# EAGLE design AS3364 bus mixer v1.0 (EAGLE 9.6.2)
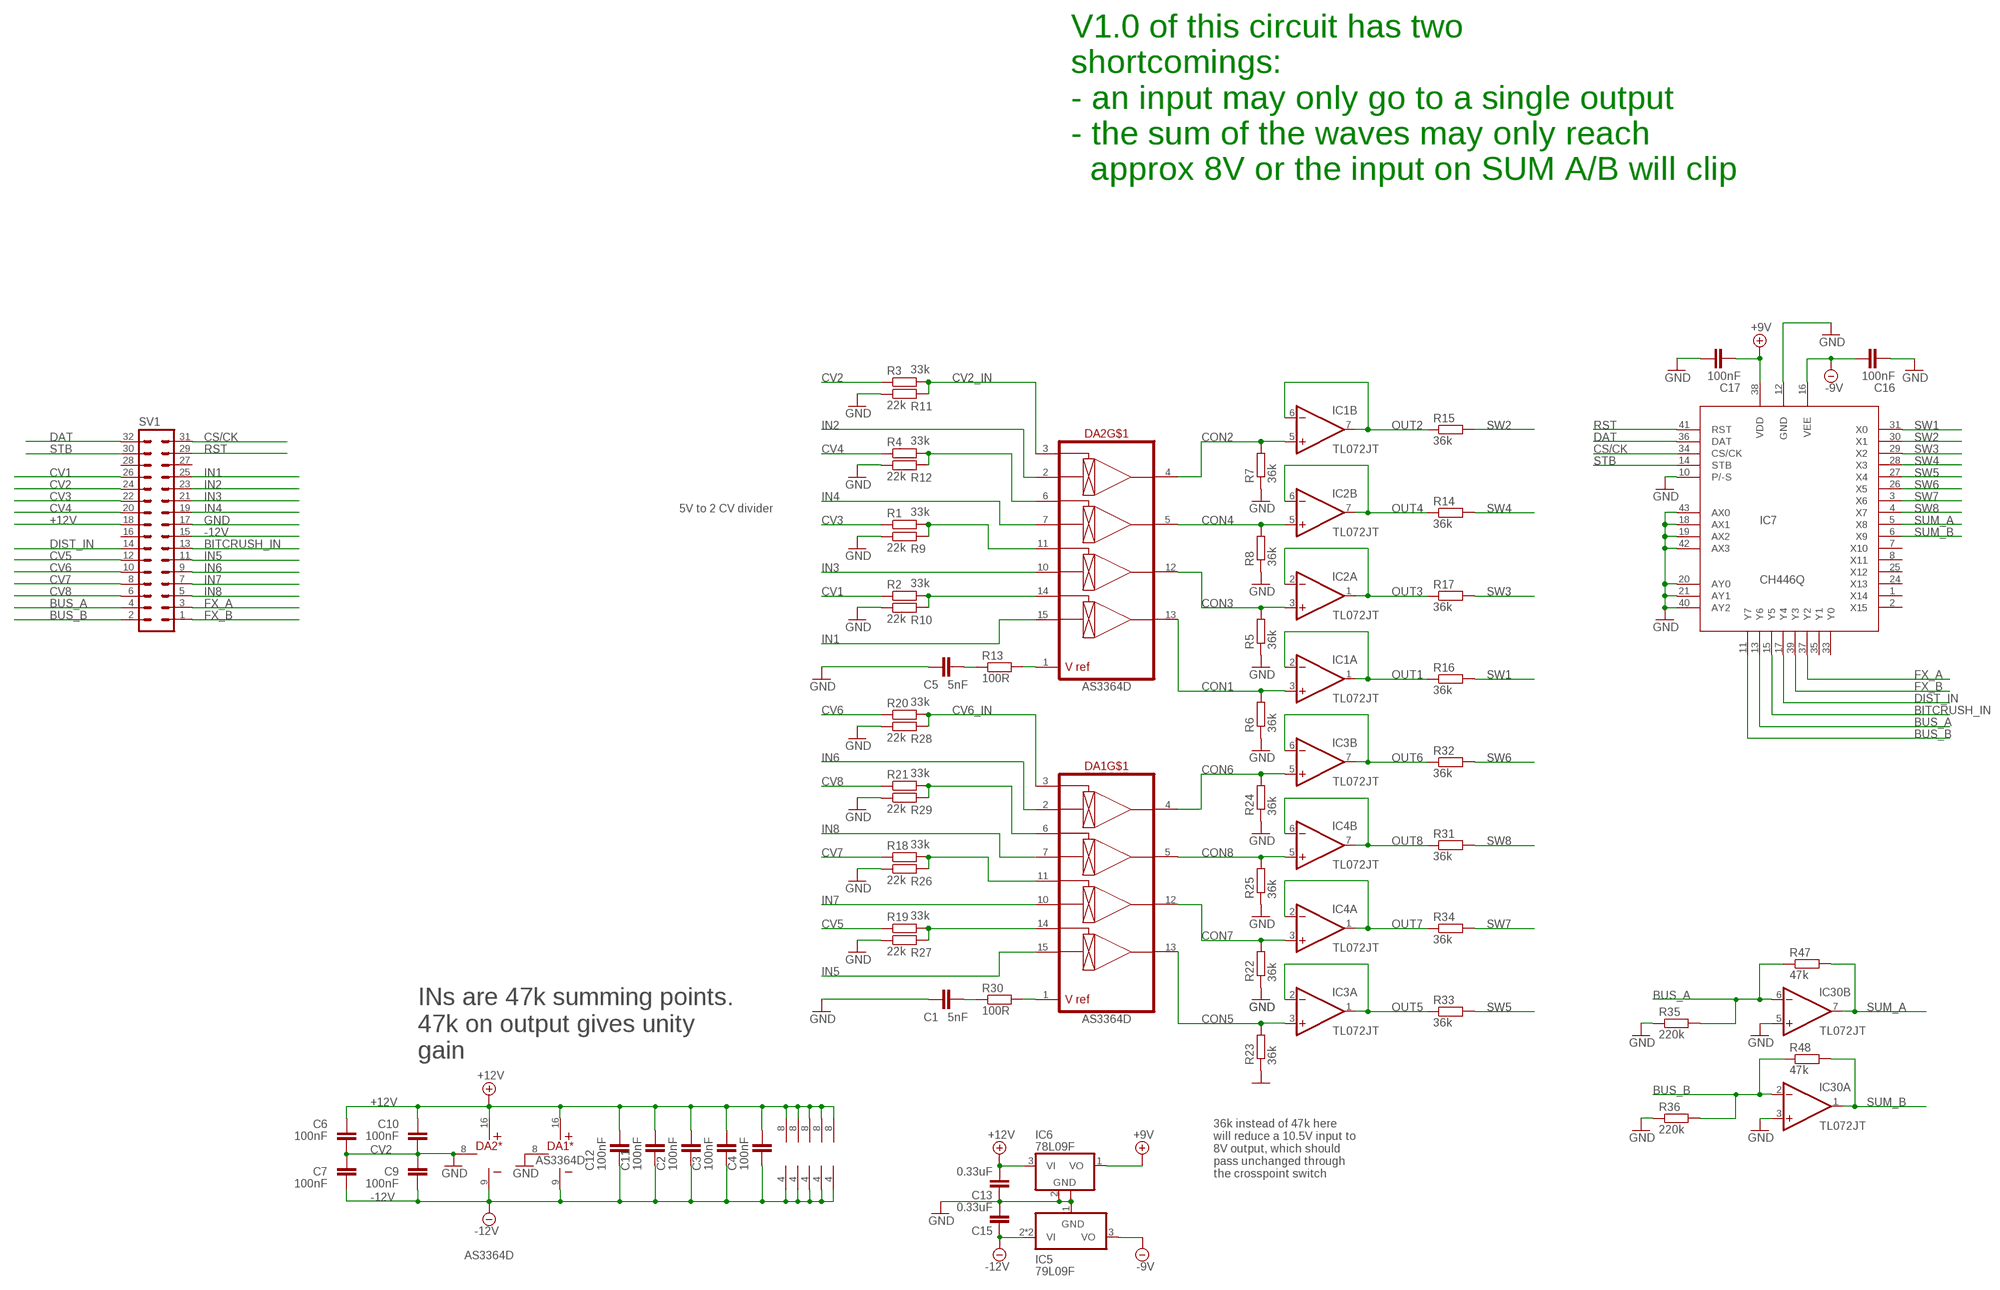
[diagram p0: schematic, sheet 1]

## Parts
C1  5nF  C-EUC0402  [C0402]
C2  100nF  C-EUC0402  [C0402]
C3  100nF  C-EUC0402  [C0402]
C4  100nF  C-EUC0402  [C0402]
C5  5nF  C-EUC0402  [C0402]
C6  100nF  C-EUC0402  [C0402]
C7  100nF  C-EUC0402  [C0402]
C9  100nF  C-EUC0402  [C0402]
C10  100nF  C-EUC0402  [C0402]
C11  100nF  C-EUC0402  [C0402]
C12  100nF  C-EUC0402  [C0402]
C13  0.33uF  C-EUC0603  [C0603]
C15  0.33uF  C-EUC0603  [C0603]
C16  100nF  C-EUC0402  [C0402]
C17  100nF  C-EUC0402  [C0402]
DA1  AS3364D  [DIL16J]
DA2  AS3364D  [DIL16J]
IC1  TL072JT  [TSSOP8J]
IC2  TL072JT  [TSSOP8J]
IC3  TL072JT  [TSSOP8J]
IC4  TL072JT  [TSSOP8J]
IC5  79L09F  [SOT89]
IC6  78L09F  [SOT89]
IC7  CH446Q  [LQFP-44-J]
IC30  TL072JT  [TSSOP8J]
R1  33k  R-EU_R0402  [R0402]
R2  33k  R-EU_R0402  [R0402]
R3  33k  R-EU_R0402  [R0402]
R4  33k  R-EU_R0402  [R0402]
R5  36k  R-EU_R0402  [R0402]
R6  36k  R-EU_R0402  [R0402]
R7  36k  R-EU_R0402  [R0402]
R8  36k  R-EU_R0402  [R0402]
R9  22k  R-EU_R0402  [R0402]
R10  22k  R-EU_R0402  [R0402]
R11  22k  R-EU_R0402  [R0402]
R12  22k  R-EU_R0402  [R0402]
R13  100R  R-EU_R0402  [R0402]
R14  36k  R-EU_R0402  [R0402]
R15  36k  R-EU_R0402  [R0402]
R16  36k  R-EU_R0402  [R0402]
R17  36k  R-EU_R0402  [R0402]
R18  33k  R-EU_R0402  [R0402]
R19  33k  R-EU_R0402  [R0402]
R20  33k  R-EU_R0402  [R0402]
R21  33k  R-EU_R0402  [R0402]
R22  36k  R-EU_R0402  [R0402]
R23  36k  R-EU_R0402  [R0402]
R24  36k  R-EU_R0402  [R0402]
R25  36k  R-EU_R0402  [R0402]
R26  22k  R-EU_R0402  [R0402]
R27  22k  R-EU_R0402  [R0402]
R28  22k  R-EU_R0402  [R0402]
R29  22k  R-EU_R0402  [R0402]
R30  100R  R-EU_R0402  [R0402]
R31  36k  R-EU_R0402  [R0402]
R32  36k  R-EU_R0402  [R0402]
R33  36k  R-EU_R0402  [R0402]
R34  36k  R-EU_R0402  [R0402]
R35  220k  R-EU_R0402  [R0402]
R36  220k  R-EU_R0402  [R0402]
R47  47k  R-EU_R0402  [R0402]
R48  47k  R-EU_R0402  [R0402]
SV1  MA16-2WJ  [MA16-2WJ]

## Nets
+9V: C17.1 IC6.1(VO) IC7.38(VDD)
+12V: C2.2 C3.2 C4.2 C6.2 C10.2 C11.2 C12.2 C13.2 DA1.16(*:V+) DA2.16(*:V+) IC1.8(P:V+) IC2.8(P:V+) IC3.8(P:V+) IC4.8(P:V+) IC6.3(VI) IC30.8(P:V+) SV1.18
-9V: C16.2 IC5.3(VO) IC7.16(VEE)
-12V: C2.1 C3.1 C4.1 C7.1 C9.1 C11.1 C12.1 C15.1 DA1.9(*:V-) DA2.9(*:V-) IC1.4(P:V-) IC2.4(P:V-) IC3.4(P:V-) IC4.4(P:V-) IC5.2(VI) IC5.2@1(VI) IC30.4(P:V-) SV1.15
BITCRUSH_IN: IC7.15(Y5) SV1.13
BUS_A: IC7.13(Y6) IC30.6(B:-IN) R35.2 R47.1 SV1.4
BUS_B: IC7.11(Y7) IC30.2(A:-IN) R36.2 R48.1 SV1.2
CON1: DA2.13(OUT4) IC1.3(A:+IN) R6.2
CON2: DA2.4(OUT1) IC1.5(B:+IN) R7.2
CON3: DA2.12(OUT3) IC2.3(A:+IN) R5.2
CON4: DA2.5(OUT2) IC2.5(B:+IN) R8.2
CON5: DA1.13(OUT4) IC3.3(A:+IN) R23.2
CON6: DA1.4(OUT1) IC3.5(B:+IN) R24.2
CON7: DA1.12(OUT3) IC4.3(A:+IN) R22.2
CON8: DA1.5(OUT2) IC4.5(B:+IN) R25.2
CS/CK: IC7.34(CS/CK) SV1.31
CV1: R2.1 SV1.26
CV2: R3.1 SV1.24
CV2_IN: DA2.3(CV1) R3.2 R11.2
CV3: R1.1 SV1.22
CV4: R4.1 SV1.20
CV5: R19.1 SV1.12
CV6: R20.1 SV1.10
CV6_IN: DA1.3(CV1) R20.2 R28.2
CV7: R18.1 SV1.8
CV8: R21.1 SV1.6
DAT: IC7.36(DAT) SV1.32
DIST_IN: IC7.17(Y4) SV1.14
FX_A: IC7.37(Y2) SV1.3
FX_B: IC7.39(Y3) SV1.1
GND: C1.1 C5.1 C6.1 C7.2 C9.2 C10.1 C13.1 C15.2 C16.1 C17.2 DA1.8(*:GND) DA2.8(*:GND) IC5.1(GND) IC6.2(GND) IC6.2@1(GND) IC7.10(P/-S) IC7.12(GND) IC7.18(AX1) IC7.19(AX2) IC7.20(AY0) IC7.21(AY1) IC7.40(AY2) IC7.42(AX3) IC7.43(AX0) IC30.3(A:+IN) IC30.5(B:+IN) R5.1 R6.1 R7.1 R8.1 R9.1 R10.1 R11.1 R12.1 R22.1 R23.1 R24.1 R25.1 R26.1 R27.1 R28.1 R29.1 R35.1 R36.1 SV1.17
IN1: DA2.15(IN4) SV1.25
IN2: DA2.2(IN1) SV1.23
IN3: DA2.10(IN3) SV1.21
IN4: DA2.7(IN2) SV1.19
IN5: DA1.15(IN4) SV1.11
IN6: DA1.2(IN1) SV1.9
IN7: DA1.10(IN3) SV1.7
IN8: DA1.7(IN2) SV1.5
N$1: DA1.1(VREF) R30.2
N$2: DA2.1(VREF) R13.2
N$3: DA1.6(CV2) R21.2 R29.2
N$5: DA1.11(CV3) R18.2 R26.2
N$7: DA1.14(CV4) R19.2 R27.2
N$8: C1.2 R30.1
N$10: DA2.6(CV2) R4.2 R12.2
N$12: DA2.11(CV3) R1.2 R9.2
N$14: C5.2 R13.1
N$21: DA2.14(CV4) R2.2 R10.2
OUT1: IC1.1(A:OUT) IC1.2(A:-IN) R16.1
OUT2: IC1.6(B:-IN) IC1.7(B:OUT) R15.1
OUT3: IC2.1(A:OUT) IC2.2(A:-IN) R17.1
OUT4: IC2.6(B:-IN) IC2.7(B:OUT) R14.1
OUT5: IC3.1(A:OUT) IC3.2(A:-IN) R33.1
OUT6: IC3.6(B:-IN) IC3.7(B:OUT) R32.1
OUT7: IC4.1(A:OUT) IC4.2(A:-IN) R34.1
OUT8: IC4.6(B:-IN) IC4.7(B:OUT) R31.1
RST: IC7.41(RST) SV1.29
STB: IC7.14(STB) SV1.30
SUM_A: IC7.5(X8) IC30.7(B:OUT) R47.2
SUM_B: IC7.6(X9) IC30.1(A:OUT) R48.2
SW1: IC7.31(X0) R16.2
SW2: IC7.30(X1) R15.2
SW3: IC7.29(X2) R17.2
SW4: IC7.28(X3) R14.2
SW5: IC7.27(X4) R33.2
SW6: IC7.26(X5) R32.2
SW7: IC7.3(X6) R34.2
SW8: IC7.4(X7) R31.2
Unconnected: IC7.1(X14) IC7.2(X15) IC7.7(X10) IC7.8(X11) IC7.24(X13) IC7.25(X12) IC7.33(Y0) IC7.35(Y1) SV1.16 SV1.27 SV1.28

## Notes on the sheet
- V1.0 of this circuit has two
  shortcomings:
  - an input may only go to a single output
  - the sum of the waves may only reach
    approx 8V or the input on SUM A/B will clip
- 5V to 2 CV divider
- INs are 47k summing points.
  47k on output gives unity
  gain
- 36k instead of 47k here 
  will reduce a 10.5V input to
  8V output, which should
  pass unchanged through
  the crosspoint switch

## Library data of the parts
C1-C7 C9-C12 C16 C17 = rcl:C-EU: CAPACITOR, European symbol; SPICEPREFIX: C
C13 C15 = resistor:C-EU: CAPACITOR, European symbol
DA1 DA2 = joakim:AS3364: AS3364 quad linear VCA, CEM3360 style. CV is 0 to 2V Vcc-Vee = 26V max, so +/-12V or +15V/-9V
IC1-IC4 IC30 = joakim:TL072J: OP AMP
IC5 = joakim:79L*: NEGATIVE-VOLTAGE REGULATORS Output up to 100 mA
IC6 = linear:78L*: POSITOIV-VOLTAGE REGULATORS Output up to 100 mA Source: Datasheet <http://focus.ti.com/lit/ds/symlink/ua78l05.pdf>
IC7 = joakim:CH446Q: 8x16 matrix analog switch chip, contains 128 analog switches, used for arbitrary routing of 8x16 signal channels. CH446 supports 4V to 12V single supply voltage, and supports +5V and -7V dual power supply voltage. The ON resistance is not greater than 65Ω. https://www.wch-ic.com/downloads/CH446DS1_PDF.html
R1-R36 R47 R48 = rcl:R-EU_: RESISTOR, European symbol; SPICEPREFIX: R
SV1 = joakim:MA16-2WJ: PIN HEADER; OC_FARNELL: unknown; OC_NEWARK: unknown

## Board
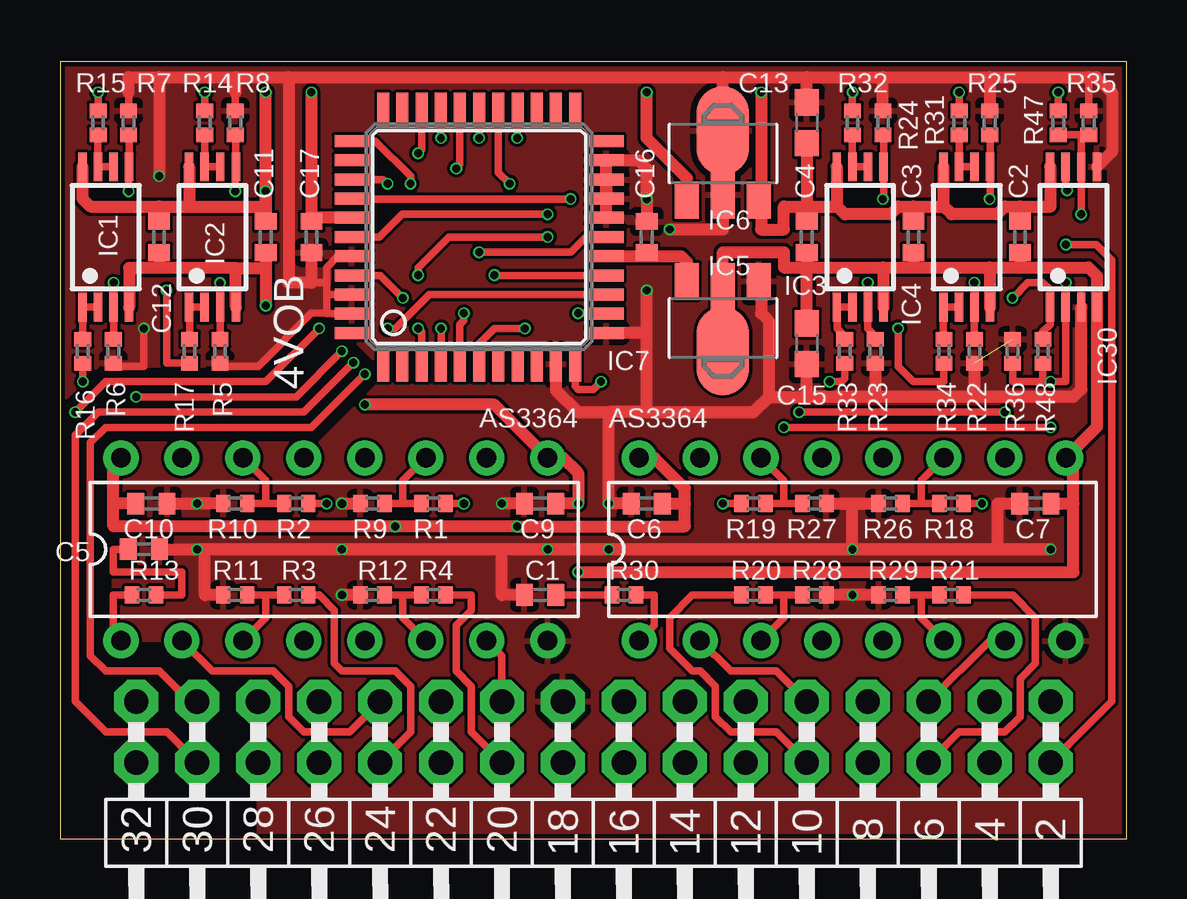
[diagram p1: board, top side]
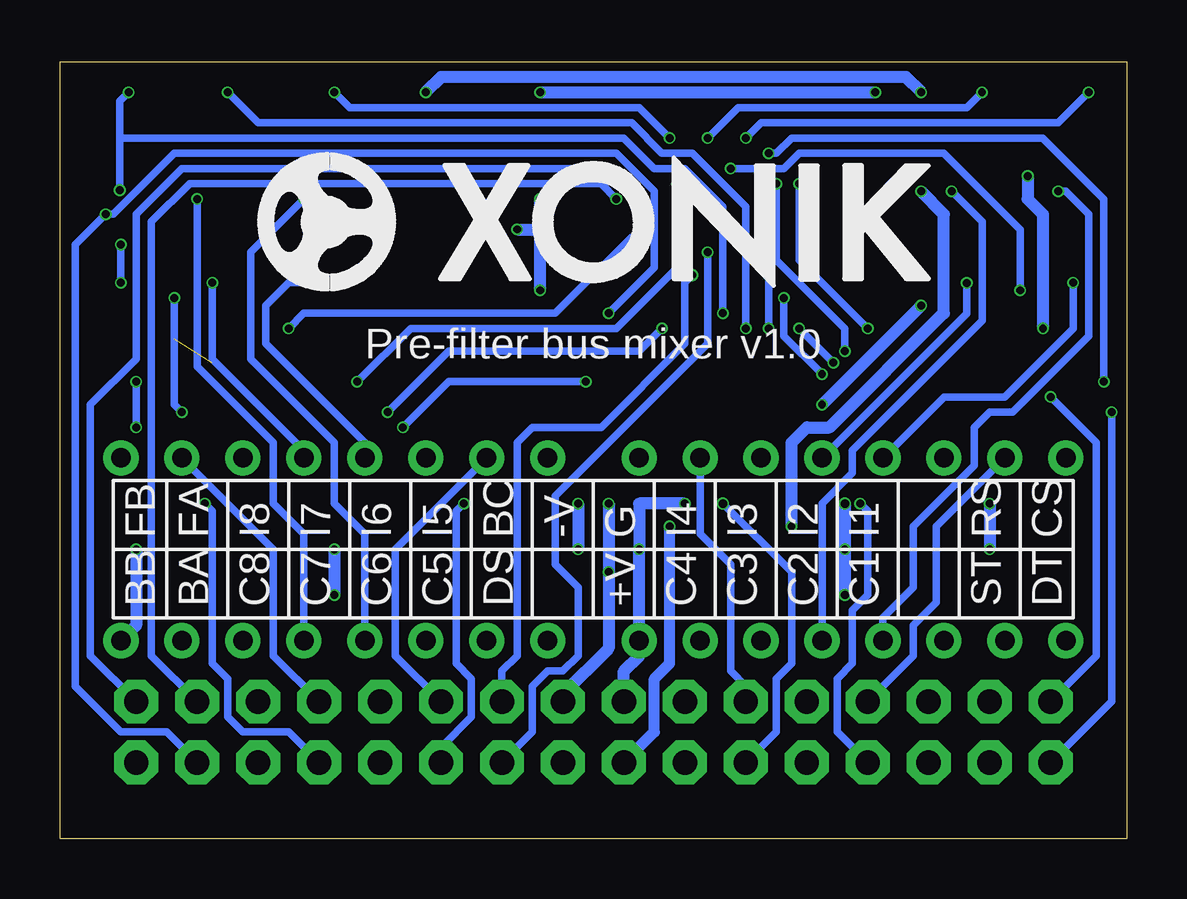
[diagram p2: board, bottom side, seen from below]

Size 44.45 x 32.38 mm. Coordinates in mm from the lower left corner, seen from the top.
Outline: 0,0 44.45,0 44.45,32.39 0,32.39 0,0
Copper layers (1*16): Top 0.035mm / dielectric 1.6mm / Bottom 0.035mm
Design rules "jlcpcb-2layers": minimum track width 5mil, minimum drill 0.3mm, track to track 5mil, track to pad 5mil, pad to pad 5mil, via to via 5mil, smd to smd 5mil, copper to edge 0.2mm, drill to drill 6mil, minimum pad ring 10mil, minimum via ring 3mil, stop-mask expansion 4mil, vias tented up to drill 0mil, thermal gap 10mil

### Footprints (pad centres in the part's own frame; a part is rotated, then mirrored left to right if it is on the bottom)
C0402 = smd 0.7 x 0.9: 1 -0.65,0; 2 0.65,0
C0603 = smd 1.1 x 1: 1 -0.85,0; 2 0.85,0
DIL16J = drill 0.813: 1 -8.89,-3.81; 2 -6.35,-3.81; 3 -3.81,-3.81; 4 -1.27,-3.81; 5 1.27,-3.81; 6 3.81,-3.81; 7 6.35,-3.81; 8 8.89,-3.81; 9 8.89,3.81; 10 6.35,3.81; 11 3.81,3.81; 12 1.27,3.81; 13 -1.27,3.81; 14 -3.81,3.81; 15 -6.35,3.81; 16 -8.89,3.81
TSSOP8J = smd 1.2 x 0.35: 1 -2.925,0.975; 2 -2.925,0.325; 3 -2.925,-0.325; 4 -2.925,-0.975; 5 2.925,-0.975; 6 2.925,-0.325; 7 2.925,0.325; 8 2.925,0.975
SOT89 = smd 1 x 1.5: 1 -1.499,-1.981; 3 1.499,-1.981 | smd 1 x 2: 2 0,-1.727 | smd 2.2 x 3.7: 2@1 0,0.94
LQFP-44-J = smd 0.5 x 1.45: 1 -4,-5.3; 2 -3.2,-5.3; 3 -2.4,-5.3; 4 -1.6,-5.3; 5 -0.8,-5.3; 6 0,-5.3; 7 0.8,-5.3; 8 1.6,-5.3; 9 2.4,-5.3; 10 3.2,-5.3; 11 4,-5.3; 23 4,5.3; 24 3.2,5.3; 25 2.4,5.3; 26 1.6,5.3; 27 0.8,5.3; 28 0,5.3; 29 -0.8,5.3; 30 -1.6,5.3; 31 -2.4,5.3; 32 -3.2,5.3; 33 -4,5.3 | smd 1.45 x 0.5: 12 5.3,-4; 13 5.3,-3.2; 14 5.3,-2.4; 15 5.3,-1.6; 16 5.3,-0.8; 17 5.3,0; 18 5.3,0.8; 19 5.3,1.6; 20 5.3,2.4; 21 5.3,3.2; 22 5.3,4; 34 -5.3,4; 35 -5.3,3.2; 36 -5.3,2.4; 37 -5.3,1.6; 38 -5.3,0.8; 39 -5.3,0; 40 -5.3,-0.8; 41 -5.3,-1.6; 42 -5.3,-2.4; 43 -5.3,-3.2; 44 -5.3,-4
R0402 = smd 0.6 x 0.7: 1 -0.5,0; 2 0.5,0
MA16-2WJ = drill 1.016 octagon: 1 -20.32,-1.27; 2 -20.32,1.27; 3 -17.78,-1.27; 4 -17.78,1.27; 5 -15.24,-1.27; 6 -15.24,1.27; 7 -12.7,-1.27; 8 -12.7,1.27; 9 -10.16,-1.27; 10 -10.16,1.27; 11 -7.62,-1.27; 12 -7.62,1.27; 13 -5.08,-1.27; 14 -5.08,1.27; 15 -2.54,-1.27; 16 -2.54,1.27; 17 0,-1.27; 18 0,1.27; 19 2.54,-1.27; 20 2.54,1.27; 21 5.08,-1.27; 22 5.08,1.27; 23 7.62,-1.27; 24 7.62,1.27; 25 10.16,-1.27; 26 10.16,1.27; 27 12.7,-1.27; 28 12.7,1.27; 29 15.24,-1.27; 30 15.24,1.27; 31 17.78,-1.27; 32 17.78,1.27

### Placement (x,y rotation side)
C1  20,10.16 0 top
C2  40.01,25.08 90 top
C3  35.56,25.08 90 top
C4  31.11,25.08 90 top
C5  3.49,12.06 180 top
C6  24.45,13.97 0 top
C7  40.64,13.97 180 top
C9  20,13.97 180 top
C10  3.81,13.97 180 top
C11  8.57,25.08 90 top
C12  4.13,25.08 90 top
C13  31.11,29.85 270 top
C15  31.11,20.64 270 top
C16  24.45,25.08 270 top
C17  10.48,25.08 270 top
DA1  33.02,12.06 0 top
DA2  11.43,12.06 0 top
IC1  1.91,25.08 90 top
IC2  6.35,25.08 90 top
IC3  33.34,25.08 90 top
IC4  37.78,25.08 90 top
IC5  27.62,21.27 180 top
IC6  27.62,28.57 0 top
IC7  17.46,25.08 0 top
IC30  42.23,25.08 90 top
R1  15.56,13.97 180 top
R2  9.84,13.97 180 top
R3  9.84,10.16 180 top
R4  15.56,10.16 180 top
R5  6.67,20.32 90 top
R6  2.22,20.32 90 top
R7  2.86,29.85 270 top
R8  7.3,29.85 270 top
R9  13.02,13.97 0 top
R10  7.3,13.97 0 top
R11  7.3,10.16 0 top
R12  13.02,10.16 0 top
R13  3.49,10.16 180 top
R14  6.03,29.85 90 top
R15  1.59,29.85 90 top
R16  0.95,20.32 270 top
R17  5.4,20.32 270 top
R18  37.15,13.97 180 top
R19  28.89,13.97 0 top
R20  28.89,10.16 0 top
R21  37.15,10.16 180 top
R22  38.1,20.32 90 top
R23  33.97,20.32 90 top
R24  34.29,29.85 270 top
R25  38.73,29.85 270 top
R26  34.61,13.97 0 top
R27  31.43,13.97 180 top
R28  31.43,10.16 180 top
R29  34.61,10.16 0 top
R30  23.5,10.16 0 top
R31  37.47,29.85 90 top
R32  33.02,29.85 90 top
R33  32.7,20.32 270 top
R34  36.83,20.32 270 top
R35  42.86,29.85 270 top
R36  39.69,20.32 270 top
R47  41.59,29.85 90 top
R48  40.96,20.32 90 top
SV1  20.95,4.45 180 top
U$1  [XONIK_LOGO_28]  36.2,22.86 0 bottom

### Tracks (layer width: path | path; a pad name or v marks a point on that pad's centre or on a via)
+9V  (via drill 0.33)
  Top 0.508: IC6.1 26.12,27.53 24.45,29.21 v24.45,31.12 | v10.48,31.12 C17.1 10.63,25.88 IC7.38
  Bottom 0.508: v24.45,31.12 v10.48,31.12
+12V  (via drill 0.33)
  Top 0.508: C6.2 26.04,13.97 | 26.04,13.97 26.04,14.6 24.77,15.87 DA1.16 | 26.04,13.97 26.04,13.02 v19.05,13.02 v13.97,13.02 2.22,13.02 2.22,13.97 | 2.22,13.97 2.22,15.56 DA2.16 | C10.2 2.22,13.97 | IC1.8 0.93,26.69 1.27,26.35 4.13,26.35 | 4.13,26.35 5.4,26.35 | 5.4,26.35 8.57,26.35 | 8.57,26.35 C11.2 v8.57,26.99 | C12.2 4.13,26.35 | IC3.8 32.36,26.37 32.38,26.35 | 35.56,26.35 36.83,26.35 | 40.01,26.35 41.27,26.35 41.27,27.98 IC30.8 | IC4.8 36.81,26.37 36.83,26.35 | C4.2 31.11,26.35 | 31.11,26.35 32.38,26.35 | 31.11,26.35 30.16,26.35 30.16,25.4 29.21,25.4 29.21,26.51 IC6.3 29.21,26.68 v29.21,31.12 | C13.2 31.11,26.35 | IC2.8 5.38,26.37 5.4,26.35 | 8.57,26.35 v8.57,26.99 | v8.57,26.99 v8.57,31.12 | C3.2 35.56,26.35 | C2.2 40.01,26.35 | 35.56,26.35 34.92,26.35 34.61,26.03 32.7,26.03 32.38,26.35 | 40.01,26.35 39.37,26.35 39.05,26.03 37.15,26.03 36.83,26.35
  Bottom 0.457: SV1.18 19.68,4.45 19.68,6.67 19.05,7.3 v19.05,13.02
  Bottom 0.508: v8.57,31.12 9.21,31.75 28.57,31.75 v29.21,31.12 | v8.57,26.99 7.62,26.03 7.62,21.91 12.38,17.14 13.34,17.14 13.97,16.51 v13.97,13.02
-9V
  Top 0.508: IC5.3 26.12,24.04 25.88,24.28 24.45,24.28 | IC7.16 24.45,24.28 | C16.2 24.45,24.28
-12V  (via drill 0.33)
  Top 0.305: IC5.2 IC5.2@1
  Top 0.508: C9.1 v21.59,13.97 21.59,15.24 20.95,15.87 DA2.9 18.1,18.1 v12.7,18.1 | 42.23,13.97 42.23,11.11 v21.59,11.11 | C7.1 42.23,13.97 | 42.23,13.97 42.23,15.56 DA1.9 43.2,17.17 IC30.4 43.2,23.47 42.86,23.81 40.01,23.81 | C11.1 8.57,23.79 | 7.3,23.79 8.57,23.79 | 7.3,23.79 4.13,23.79 | 4.13,23.79 2.88,23.79 IC1.4 | C12.1 4.13,23.79 | C4.1 31.11,23.81 | 31.11,23.81 34.29,23.81 | IC5.2 27.62,24.45 30.16,24.45 30.16,23.81 31.11,23.81 | C15.1 31.11,23.81 | IC2.4 7.33,23.77 7.3,23.79 | 8.57,23.79 v8.57,22.23 | 34.29,23.81 34.31,23.79 IC3.4 | 34.29,23.81 35.56,23.81 | 35.56,23.81 38.73,23.81 | 38.73,23.81 40.01,23.81 | C2.1 40.01,23.81 | C3.1 35.56,23.81 | 38.73,23.81 38.76,23.79 IC4.4
  Bottom 0.508: SV1.15 23.5,6.03 21.59,7.94 v21.59,11.11 v21.59,13.97 | v12.7,18.1 v8.57,22.23
BITCRUSH_IN  (via drill 0.33)
  Top 0.305: IC7.15 v18.11,23.48 v18.1,23.49
  Bottom 0.305: SV1.13 26.04,6.99 25.4,7.62 25.4,16.51 24.77,17.14 21.91,17.14 18.41,20.64 18.41,23.18 v18.1,23.49
BUS_A  (via drill 0.33)
  Top 0.305: IC7.13 22.74,21.91 v21.59,21.91 | v42.55,26.03 IC30.6 42.55,28.01 42.55,29.35 | R47.1 42.55,29.35 | 42.55,29.35 R35.2
  Bottom 0.305: SV1.4 40.01,4.45 41.91,4.45 43.81,6.35 43.81,24.76 v42.55,26.03 42.23,26.03 39.69,28.57 21.27,28.57 19.68,26.99 19.68,23.81 v21.59,21.91
BUS_B  (via drill 0.33)
  Top 0.305: SV1.2 43.81,5.71 43.81,24.13 43.18,24.76 v41.91,24.76 | IC7.11 21.46,18.86 21.59,18.73 22.23,18.73 v22.54,19.05 | v30.16,17.14 v41.27,17.14 | v41.91,23.18 41.91,22.17 IC30.2 41.9,20.92 41.9,19.05 v41.27,19.05 40.96,19.05 | R36.2 39.69,19.05 40.96,19.05 | R48.1 40.96,19.05
  Bottom 0.305: v22.54,19.05 28.26,19.05 v30.16,17.14 | v41.27,17.14 v41.27,19.05 | v41.91,24.76 v41.91,23.18
CON1  (via drill 0.33)
  Top 0.305: R6.2 IC1.3 2.22,22.17 2.22,23.18 v2.23,23.18
  Bottom 0.305: DA2.13 7.61,18.42 5.08,18.42 2.23,21.26 v2.23,23.18
CON2  (via drill 0.33)
  Top 0.305: R7.2 2.88,29.32 IC1.5 2.86,27.98 v2.86,26.99
  Bottom 0.305: DA2.4 10.16,9.21 8.89,10.48 8.89,13.02 6.35,15.56 6.35,17.14 5.71,17.78 4.76,17.78 1.59,20.96 1.59,26.03 2.54,26.99 v2.86,26.99
CON3  (via drill 0.33)
  Top 0.305: v6.67,23.17 6.67,22.17 IC2.3 R5.2
  Bottom 0.305: DA2.12 6.67,21.9 v6.67,23.17
CON4  (via drill 0.33)
  Top 0.305: v7.3,26.99 7.3,27.98 IC2.5 7.33,29.32 R8.2
  Bottom 0.305: DA2.5 12.7,13.97 11.43,15.24 11.43,16.19 6.03,21.59 6.03,25.72 v7.3,26.99
CON5  (via drill 0.33)
  Top 0.305: v33.66,23.18 33.66,22.17 IC3.3 33.66,21.28 33.66,21.27 33.97,20.96 R23.2
  Bottom 0.305: DA1.13 31.75,16.51 35.88,20.64 35.88,22.23 34.92,23.18 v33.66,23.18
CON6  (via drill 0.33)
  Top 0.305: R24.2 34.31,29.32 IC3.5 34.31,26.69 v34.29,26.67
  Bottom 0.305: DA1.4 31.75,12.7 33.02,13.97 33.02,16.51 36.51,20 36.51,24.45 v34.29,26.67
CON7  (via drill 0.33)
  Top 0.305: v38.1,23.18 38.11,23.17 IC4.3 R22.2
  Bottom 0.305: DA1.12 34.29,16.19 38.1,20 v38.1,23.18
CON8  (via drill 0.33)
  Top 0.305: v38.73,26.67 38.76,26.69 IC4.5 38.76,29.32 R25.2
  Bottom 0.305: DA1.5 34.29,12.7 35.56,13.97 35.56,16.51 38.73,19.69 v38.73,26.67
CS/CK  (via drill 0.33)
  Top 0.305: v3.17,18.42 9.84,18.42 v11.75,20.32 | v14.61,27.3 14.61,27.62 13.14,29.08 IC7.34
  Bottom 0.305: SV1.31 1.27,7.62 1.27,16.51 v3.17,18.42 | v11.75,20.32 11.75,21.27 14.61,24.13 v14.61,27.3
CV1  (via drill 0.33)
  Top 0.305: v11.11,13.97 R2.1
  Bottom 0.305: SV1.26 12.06,4.45 12.06,6.67 11.43,7.3 11.43,9.52 10.79,10.16 10.79,13.65 v11.11,13.97
CV2
  Top 0.305: SV1.24 14.61,4.45 14.61,6.35 13.97,6.99 11.75,6.99 11.43,7.3 11.43,9.52 10.79,10.16 R3.1
CV2_IN
  Top 0.305: 8.57,10.16 8.57,9.21 DA2.3 | R3.2 8.57,10.16 | 8.57,10.16 R11.2
CV3  (via drill 0.35)
  Top 0.305: v16.83,13.97 R1.1
  Bottom 0.305: SV1.22 14.61,4.45 14.61,6.67 13.97,7.3 13.97,11.11 v16.83,13.97
CV4
  Top 0.305: SV1.20 17.14,4.45 17.14,6.35 16.51,6.99 16.51,8.89 17.14,9.52 17.14,10.16 R4.1
CV5  (via drill 0.33)
  Top 0.305: v27.62,13.97 R19.1
  Bottom 0.305: SV1.12 28.57,3.81 27.3,5.08 27.3,6.67 27.94,7.3 27.94,13.65 v27.62,13.97
CV6
  Top 0.305: SV1.10 29.84,4.45 27.94,4.45 27.3,5.08 27.3,6.35 26.67,6.99 26.35,6.99 25.4,7.94 25.4,9.21 26.35,10.16 R20.1
CV6_IN
  Top 0.305: R20.2 30.16,10.16 | 30.16,10.16 R28.2 | DA1.3 30.16,9.21 30.16,10.16
CV7  (via drill 0.33)
  Top 0.305: v38.42,13.97 R18.1
  Bottom 0.305: v38.42,13.97 38.1,13.65 38.1,7.3 37.47,6.67 37.47,5.08 36.83,4.45 34.92,4.45 SV1.8
CV8
  Top 0.305: R21.1 39.69,10.16 40.64,9.21 40.64,7.3 40.01,6.67 40.01,5.08 39.37,4.45 37.47,4.45 SV1.6
DAT  (via drill 0.33)
  Top 0.305: v0.64,17.78 1.91,19.05 8.57,19.05 v10.79,21.27 | IC7.36 13.47,27.48 v13.65,27.3
  Bottom 0.305: v0.64,17.78 0.64,5.71 SV1.32 | v13.65,27.3 13.65,24.13 v10.79,21.27
DIST_IN  (via drill 0.33)
  Top 0.305: v17.46,24.45 21.27,24.45 21.91,25.08 IC7.17
  Bottom 0.305: SV1.14 24.77,4.45 24.77,6.35 24.13,6.99 23.5,6.99 22.86,7.62 22.86,10.48 23.81,11.43 23.81,14.29 17.46,20.64 v17.46,24.45
FX_A  (via drill 0.33)
  Top 0.305: v21.27,26.67 13.02,26.67 13.01,26.68 IC7.37
  Bottom 0.305: SV1.3 40.64,7.62 40.64,25.72 39.05,27.3 21.91,27.3 v21.27,26.67
FX_B  (via drill 0.33)
  Top 0.305: v20.32,26.03 14.26,26.03 13.31,25.08 IC7.39
  Bottom 0.305: SV1.1 43.18,7.62 43.18,18.1 41.27,20 41.27,26.03 39.37,27.94 21.59,27.94 20.32,26.67 v20.32,26.03
GND  (via drill 0.33, 0.35)  (1 unrouted)
  Top 0.305: R8.1 7.3,31.12 | R7.1 2.86,31.12 | IC7.40 11.58,24.28 11.11,23.81 11.11,23.18 | 11.11,23.18 11.11,22.68 | 11.11,21.91 11.11,21.88 IC7.43 | IC7.42 11.11,22.68 | v3.49,21.27 3.49,19.69 2.36,19.69 R6.1 | 11.11,21.91 10.48,21.91 8.26,19.69 6.8,19.69 R5.1 | 11.11,23.18 10.48,23.18 | 11.11,22.68 11.11,21.91 | R35.1 42.86,31.75
  Top 0.508: R12.1 v11.75,10.16 | v11.75,13.97 R9.1 | v33.02,12.07 v22.86,12.07 v20.32,12.07 18.41,12.07 | 18.41,12.07 v11.75,12.07 6.03,12.07 | C9.2 v18.41,13.97 | 6.03,12.07 v5.71,12.07 C5.1 | C1.1 18.41,10.16 18.41,12.07 | R27.1 33.02,13.97 | 33.02,13.97 R26.1 | v33.02,12.07 33.02,13.97 | C7.2 39.05,13.97 39.05,12.07 | 39.05,12.07 v33.02,12.07 | v41.27,12.07 39.05,12.07 | C6.1 v22.86,13.97 22.86,17.78 | R29.1 v33.02,10.16 R28.1 | R11.1 6.03,10.16 6.03,12.07 | R10.1 v5.71,13.97 C10.1 | 2.86,31.12 2.86,31.75 4.13,31.75 | 4.13,31.75 7.3,31.75 | 7.3,31.75 7.3,31.12 | 7.3,31.75 9.53,31.75 | 9.53,31.75 27.62,31.75 | 27.62,31.75 31.11,31.75 | 31.11,31.75 34.29,31.75 | 34.29,31.75 38.73,31.75 | 38.73,31.75 R25.1 | R24.1 34.29,31.75 | 38.73,31.75 42.86,31.75 43.18,31.75 43.84,31.09 43.84,28.64 IC30.5 | 4.13,31.75 v4.13,27.62 | 9.53,31.75 9.53,23.18 10.48,23.18 C17.2 | C13.1 31.11,31.75 | R22.1 38.1,18.42 | 38.1,18.42 42.23,18.42 42.55,18.74 IC30.3 | 38.1,18.42 33.97,18.42 | 33.97,18.42 31.11,18.42 | 31.11,18.42 C15.2 | R23.1 33.97,18.42 | IC5.1 29.21,23.17 29.21,21.91 29.53,21.59 29.53,18.42 | 29.53,18.42 31.11,18.42 | 24.45,17.78 22.86,17.78 | 24.45,17.78 24.45,20.96 | 24.45,20.96 v24.45,22.86 | C16.1 v24.45,26.67 24.45,27.94 24.11,28.28 IC7.21 IC7.19 | v25.4,25.4 27.62,25.4 IC6.2 IC6.2@1 27.62,31.75 | IC7.10 20.66,18.71 21.59,17.78 22.86,17.78 | 24.45,20.96 24.32,21.08 IC7.12 | IC7.18 IC7.19 | IC7.20 IC7.19 | 29.53,18.42 28.89,17.78 24.45,17.78
  Bottom 0.508: v18.41,13.97 20.32,13.97 v20.32,12.07 DA2.8 20.32,7.62 20.95,6.99 SV1.17 | v11.75,13.97 v11.75,12.07 v11.75,10.16 | DA1.8 41.27,8.89 v41.27,12.07 | v22.86,13.97 v22.86,12.07 | v33.02,12.07 v33.02,10.16 | v5.71,13.97 v5.71,12.07 | v4.13,27.62 4.13,26.67 3.49,26.03 v3.49,21.27 | v24.45,22.86 24.45,25.4 | 24.45,25.4 v24.45,26.67 | v25.4,25.4 24.45,25.4
  pour Top: -0.32,32.7 44.77,32.7 44.77,-0.32 8.26,-0.32 8.26,5.08 5.08,8.25 2.22,8.25 2.22,15.56 3.17,16.51 10.79,16.51 13.65,19.37 11.11,21.91 10.48,21.91 8.26,19.69 1.59,19.69 0,18.1 -0.32,18.1
IN1
  Bottom 0.305: DA2.15 7.94,13.02 7.94,9.84 8.89,8.89 8.89,7.62 SV1.25
IN2
  Top 0.305: DA2.2 6.35,6.99 8.89,6.99 9.53,6.35 9.53,5.08 10.16,4.45 12.06,4.45 SV1.23
IN3
  Bottom 0.305: SV1.21 15.88,6.35 16.51,6.99 16.51,11.43 17.78,12.7 DA2.10
IN4
  Top 0.305: SV1.19 18.41,7.62 DA2.7
IN5
  Bottom 0.305: DA1.15 30.48,12.07 30.48,7.62 SV1.11
IN6
  Top 0.305: DA1.2 27.94,6.99 29.84,6.99 SV1.9
IN7
  Bottom 0.305: SV1.7 35.56,7.62 35.56,12.07 DA1.10
IN8
  Top 0.305: SV1.5 38.73,8.25 DA1.7
N$1
  Top 0.305: DA1.1 24.77,8.89 24.77,10.16 R30.2
N$2
  Top 0.305: DA2.1 2.22,8.57 2.22,10.16 R13.2
N$3
  Top 0.305: R21.2 35.88,10.16 | 35.88,10.16 R29.2 | DA1.6 35.88,9.21 35.88,10.16
N$5
  Top 0.305: R26.2 35.88,13.97 | R18.2 35.88,13.97 | DA1.11 35.88,14.92 35.88,13.97
N$7
  Top 0.305: R19.2 30.16,13.97 | 30.16,13.97 R27.2 | DA1.14 30.16,14.92 30.16,13.97
N$8
  Top 0.305: C1.2 R30.1
N$10
  Top 0.305: R12.2 R4.2 14.29,10.16 14.29,9.21 DA2.6
N$12
  Top 0.305: 14.29,13.97 14.29,14.92 DA2.11 | R1.2 14.29,13.97 | 14.29,13.97 R9.2
N$14
  Top 0.305: C5.2 2.22,12.07 2.22,11.11 5.08,11.11 5.08,10.16 R13.1
N$21
  Top 0.305: 8.57,13.97 8.57,14.92 DA2.14 | R2.2 8.57,13.97 | 8.57,13.97 R10.2
OUT1
  Top 0.305: IC1.2 IC1.1 0.95,22.14 R16.1
OUT2
  Top 0.305: R15.1 IC1.7 IC1.6
OUT3
  Top 0.305: IC2.2 IC2.1 5.4,22.14 R17.1
OUT4
  Top 0.305: R14.1 6.03,28.01 IC2.7 IC2.6
OUT5
  Top 0.305: IC3.2 IC3.1 32.38,22.14 32.38,21.27 32.7,20.96 R33.1
OUT6
  Top 0.305: R32.1 33.02,28.01 IC3.7 IC3.6
OUT7
  Top 0.305: IC4.2 IC4.1 36.81,20.84 R34.1
OUT8
  Top 0.305: R31.1 37.47,28.01 IC4.7 IC4.6
RST  (via drill 0.33)
  Top 0.305: SV1.29 5.4,5.71 4.13,6.99 1.91,6.99 1.27,7.62 1.27,16.51 1.91,17.14 10.48,17.14 v12.7,19.37 | v14.29,22.54 13.35,23.48 IC7.41
  Bottom 0.305: v12.7,19.37 14.29,20.96 v14.29,22.54
STB  (via drill 0.33)
  Top 0.305: SV1.30 4.45,4.45 1.91,4.45 0.64,5.71 0.64,16.83 1.59,17.78 10.16,17.78 v12.22,19.84 | v13.65,21.27 13.97,21.27 15.38,22.68 IC7.14
  Bottom 0.305: v13.65,21.27 v12.22,19.84
SUM_A  (via drill 0.33)
  Top 0.305: R47.2 v41.59,31.12 | IC7.5 16.66,21.42 16.83,21.59 v16.83,21.91 | IC30.7 41.91,26.99 v41.96,27.04
  Bottom 0.305: v16.83,21.91 16.83,26.35 18.41,27.94 19.68,27.94 20.95,29.21 41.96,29.21 | v41.59,31.12 41.96,30.75 41.96,29.21 | 41.96,29.21 v41.96,27.04
SUM_B  (via drill 0.33)
  Top 0.305: R48.2 40.96,21.14 41.25,21.43 41.25,21.91 | 41.25,21.91 IC30.1 | IC7.6 17.46,20.64 18.1,21.27 v19.37,21.27 | v30.8,17.78 v39.37,17.78 | v39.69,22.54 40.32,23.18 40.96,23.18 41.27,22.86 41.27,21.93 41.25,21.91
  Bottom 0.305: v19.37,21.27 20.32,20.32 28.26,20.32 v30.8,17.78 | v39.37,17.78 39.69,18.1 v39.69,22.54
SW1  (via drill 0.33)
  Top 0.305: R16.2 v0.95,19.05 | v14.92,28.57 15.07,28.73 15.06,28.74 IC7.31
  Bottom 0.305: v0.95,19.05 0.95,26.67 3.49,29.21 13.97,29.21 14.61,28.57 v14.92,28.57
SW2  (via drill 0.33)
  Top 0.305: R15.2 v1.59,31.12 | IC7.30 15.86,29.22 v15.88,29.21
  Bottom 0.305: v1.59,31.12 2.86,29.85 15.24,29.85 v15.88,29.21
SW3  (via drill 0.33)
  Top 0.305: R17.2 4.45,19.82 v4.45,22.86 | v16.51,27.94 16.51,27.98 16.66,28.13 IC7.29
  Bottom 0.305: v4.45,22.86 4.45,25.4 7.62,28.57 13.65,28.57 14.29,27.94 v16.51,27.94
SW4  (via drill 0.33)
  Top 0.305: R14.2 v6.03,31.12 | IC7.28 v17.46,29.21
  Bottom 0.305: v6.03,31.12 6.67,30.48 16.19,30.48 v17.46,29.21
SW5  (via drill 0.33)
  Top 0.305: R33.2 32.7,19.19 32.57,19.05 v32.07,19.05 | IC7.27 18.26,27.78 v18.73,27.3
  Bottom 0.305: v32.07,19.05 29.84,21.27 21.27,21.27 18.73,23.81 v18.73,27.3
SW6  (via drill 0.33)
  Top 0.305: R32.2 v33.02,31.12 | v19.05,29.21 19.05,30.37 IC7.26
  Bottom 0.305: v33.02,31.12 32.38,30.48 20.32,30.48 v19.05,29.21
SW7  (via drill 0.33)
  Top 0.305: R34.2 36.83,19.05 35.56,19.05 34.92,19.69 v34.92,21.27 | v14.92,23.49 14.92,23.81 16.19,25.08 v20.32,25.08 | IC7.3 15.06,21.13 v14.92,21.27
  Bottom 0.305: v34.92,21.27 34.29,21.91 23.81,21.91 20.64,25.08 v20.32,25.08 | v14.92,21.27 v14.92,23.49
SW8  (via drill 0.33)
  Top 0.305: R31.2 v37.47,31.12 | v15.88,21.27 15.88,19.8 IC7.4
  Bottom 0.305: v37.47,31.12 36.2,29.85 20.64,29.85 19.37,28.57 18.1,28.57 15.88,26.35 v15.88,21.27

### Text on the board
tNames: 4VOB | AS3364 | AS3364
bNames: Pre-filter bus mixer v1.0 | CS | RS | I1 | I2 | I3 | I4 | G | -V | BC | I5 | I6 | I7 | I8 | FA | FB | DT | ST | C1 | C2 | C3 | C4 | +V | DS | C5 | C6 | C7 | C8 | BA | BB